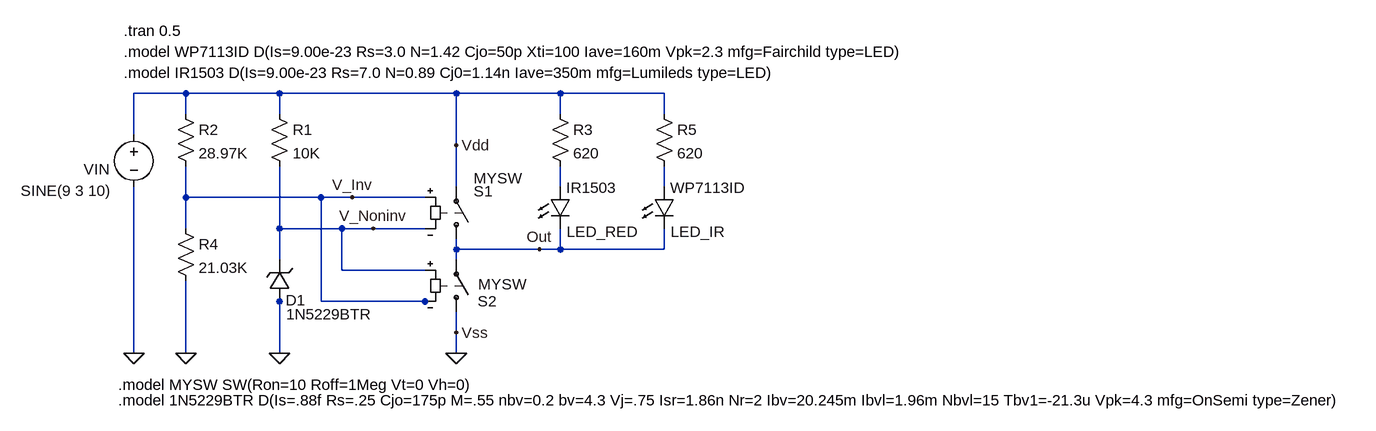
[diagram p0: schematic Miguel Villa Floran - CPE 145 Final.asc]
Miguel Villa Floran - CPE 145 Final.asc, the LTspice schematic file:
Version 4
SHEET 1 3576 680
WIRE 416 -96 336 -96
WIRE 560 -96 416 -96
WIRE 832 -96 560 -96
WIRE 992 -96 832 -96
WIRE 1152 -96 992 -96
WIRE 416 -64 416 -96
WIRE 560 -64 560 -96
WIRE 992 -64 992 -96
WIRE 1152 -64 1152 -96
WIRE 336 -32 336 -96
WIRE 832 -16 832 -96
WIRE 832 48 832 -16
WIRE 992 48 992 16
WIRE 1152 48 1152 16
WIRE 416 64 416 16
WIRE 624 64 416 64
WIRE 672 64 624 64
WIRE 784 64 672 64
WIRE 416 112 416 64
WIRE 560 112 560 16
WIRE 656 112 560 112
WIRE 704 112 656 112
WIRE 784 112 704 112
WIRE 832 144 832 128
WIRE 960 144 832 144
WIRE 992 144 992 112
WIRE 992 144 960 144
WIRE 1152 144 1152 112
WIRE 1152 144 992 144
WIRE 560 160 560 112
WIRE 832 160 832 144
WIRE 656 176 656 112
WIRE 784 176 656 176
WIRE 560 224 560 208
WIRE 624 224 624 64
WIRE 784 224 624 224
WIRE 800 224 784 224
WIRE 832 272 832 240
WIRE 336 304 336 48
WIRE 416 304 416 192
WIRE 560 304 560 224
WIRE 832 304 832 272
FLAG 560 304 0
FLAG 832 304 0
FLAG 336 304 0
FLAG 672 64 V_Inv
FLAG 704 112 V_Noninv
FLAG 960 144 Out
FLAG 416 304 0
FLAG 832 -16 Vdd
FLAG 832 272 Vss
SYMBOL res 544 -80 R0
SYMATTR InstName R1
SYMATTR Value 10K
SYMBOL res 400 -80 R0
SYMATTR InstName R2
SYMATTR Value 28.97K
SYMBOL zener 576 224 R180
WINDOW 0 -24 2 Left 2
WINDOW 3 -127 -20 Left 2
SYMATTR InstName D1
SYMATTR Value 1N5229BTR
SYMBOL sw 832 144 M180
WINDOW 0 27 89 Left 2
WINDOW 3 27 109 Left 2
SYMATTR InstName S1
SYMATTR Value MYSW
SYMBOL sw 832 256 M180
WINDOW 0 33 32 Left 2
WINDOW 3 34 58 Left 2
SYMATTR InstName S2
SYMATTR Value MYSW
SYMBOL LED 1136 48 R0
WINDOW 0 26 69 Left 2
WINDOW 3 25 1 Left 2
SYMATTR InstName LED_IR
SYMATTR Value WP7113ID
SYMBOL voltage 336 -48 R0
WINDOW 123 0 0 Left 0
WINDOW 39 0 0 Left 0
WINDOW 0 -77 69 Left 2
WINDOW 3 -174 102 Left 2
SYMATTR InstName VIN
SYMATTR Value SINE(9 3 10)
SYMBOL res 976 -80 R0
SYMATTR InstName R3
SYMATTR Value 620
SYMBOL res 400 96 R0
SYMATTR InstName R4
SYMATTR Value 21.03K
SYMBOL LED 976 48 R0
WINDOW 0 26 69 Left 2
WINDOW 3 25 1 Left 2
SYMATTR InstName LED_RED
SYMATTR Value IR1503
SYMATTR Description Diode
SYMATTR Type diode
SYMBOL res 1136 -80 R0
SYMATTR InstName R5
SYMATTR Value 620
TEXT 312 376 Left 2 !.model 1N5229BTR D(Is=.88f Rs=.25 Cjo=175p M=.55 nbv=0.2 bv=4.3 Vj=.75 Isr=1.86n Nr=2 Ibv=20.245m Ibvl=1.96m Nbvl=15 Tbv1=-21.3u Vpk=4.3 mfg=OnSemi type=Zener)
TEXT 320 -192 Left 2 !.tran 0.5
TEXT 312 352 Left 2 !.model MYSW SW(Ron=10 Roff=1Meg Vt=0 Vh=0)
TEXT 320 -160 Left 2 !.model WP7113ID D(Is=9.00e-23 Rs=3.0 N=1.42 Cjo=50p Xti=100 Iave=160m Vpk=2.3 mfg=Fairchild type=LED)
TEXT 320 -128 Left 2 !.model IR1503 D(Is=9.00e-23 Rs=7.0 N=0.89 Cj0=1.14n Iave=350m mfg=Lumileds type=LED)

The netlist it stands for:
* Miguel Villa Floran - CPE 145 Final.asc
R1 Vdd V_Noninv 10K
R2 Vdd V_Inv 28.97K
D1 0 V_Noninv 1N5229BTR
S1 Out Vdd V_Inv V_Noninv MYSW
S2 0 Out V_Noninv V_Inv MYSW
D§LED_IR N002 Out WP7113ID
VIN Vdd 0 SINE(9 3 10)
R3 Vdd N001 620
R4 V_Inv 0 21.03K
D§LED_RED N001 Out IR1503
R5 Vdd N002 620
.model D D
.lib standard.dio
.model 1N5229BTR D(Is=.88f Rs=.25 Cjo=175p M=.55 nbv=0.2 bv=4.3 Vj=.75 Isr=1.86n Nr=2 Ibv=20.245m Ibvl=1.96m Nbvl=15 Tbv1=-21.3u Vpk=4.3 mfg=OnSemi type=Zener)
.tran 0.5
.model MYSW SW(Ron=10 Roff=1Meg Vt=0 Vh=0)
.model WP7113ID D(Is=9.00e-23 Rs=3.0 N=1.42 Cjo=50p Xti=100 Iave=160m Vpk=2.3 mfg=Fairchild type=LED)
.model IR1503 D(Is=9.00e-23 Rs=7.0 N=0.89 Cj0=1.14n Iave=350m mfg=Lumileds type=LED)
.backanno
.end